# EAGLE design ProtoHu_revA_layer1 (EAGLE 9.4.0)
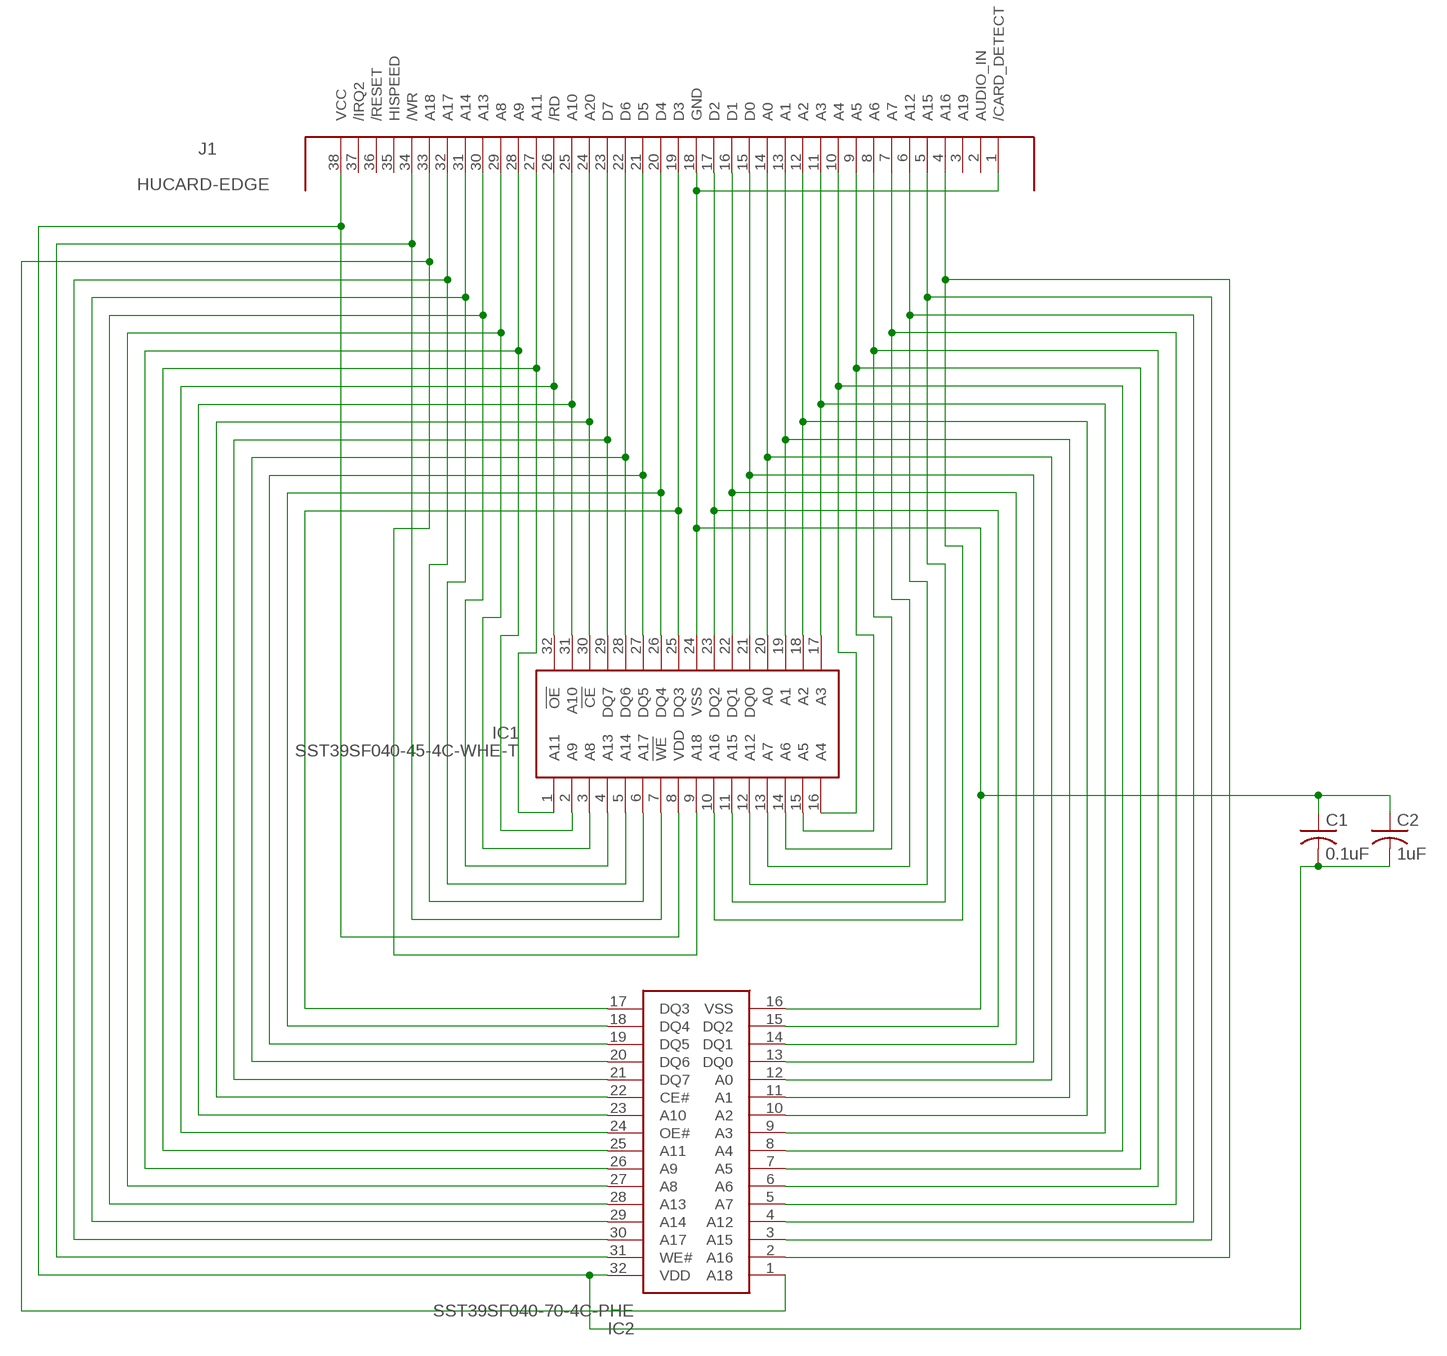
[diagram p0: schematic, sheet 1]

## Parts
C1  0.1uF  C-USC0603  [C0603]
C2  1uF  C-USC0603  [C0603]
IC1  SST39SF040-45-4C-WHE-T  [SOP50P1400X120-32N]
IC2  SST39SF040-70-4C-PHE  [DIP1556W56P254L4191H508Q32N]
J1  HUCARD-EDGE  [HUCARD-EDGE]

## Nets
GND: C1.1 C2.1 IC1.24(VSS) IC2.16(VSS) J1.1(/CARD_DETECT) J1.18(GND)
N$1: IC1.14(A6) IC2.6(A6) J1.8(A6)
N$2: IC1.13(A7) IC2.5(A7) J1.7(A7)
N$3: IC1.12(A12) IC2.4(A12) J1.6(A12)
N$4: IC1.25(DQ3) IC2.17(DQ3) J1.19(D3)
N$5: IC1.26(DQ4) IC2.18(DQ4) J1.20(D4)
N$6: IC1.27(DQ5) IC2.19(DQ5) J1.21(D5)
N$7: IC1.11(A15) IC2.3(A15) J1.5(A15)
N$8: IC1.10(A16) IC2.2(A16) J1.4(A16)
N$9: IC1.23(DQ2) IC2.15(DQ2) J1.17(D2)
N$10: IC1.22(DQ1) IC2.14(DQ1) J1.16(D1)
N$11: IC1.21(DQ0) IC2.13(DQ0) J1.15(D0)
N$12: IC1.7(!WE) IC2.31(WE#) J1.34(/WR)
N$14: IC1.28(DQ6) IC2.20(DQ6) J1.22(D6)
N$15: IC1.29(DQ7) IC2.21(DQ7) J1.23(D7)
N$16: IC1.30(!CE) IC2.22(CE#) J1.24(A20)
N$17: IC1.31(A10) IC2.23(A10) J1.25(A10)
N$18: IC1.32(!OE) IC2.24(OE#) J1.26(/RD)
N$19: IC1.1(A11) IC2.25(A11) J1.27(A11)
N$20: IC1.2(A9) IC2.26(A9) J1.28(A9)
N$21: IC1.20(A0) IC2.12(A0) J1.14(A0)
N$22: IC1.19(A1) IC2.11(A1) J1.13(A1)
N$23: IC1.18(A2) IC2.10(A2) J1.12(A2)
N$24: IC1.17(A3) IC2.9(A3) J1.11(A3)
N$25: IC1.3(A8) IC2.27(A8) J1.29(A8)
N$26: IC1.4(A13) IC2.28(A13) J1.30(A13)
N$27: IC1.5(A14) IC2.29(A14) J1.31(A14)
N$28: IC1.6(A17) IC2.30(A17) J1.32(A17)
N$29: IC1.16(A4) IC2.8(A4) J1.10(A4)
N$30: IC1.15(A5) IC2.7(A5) J1.9(A5)
N$31: IC1.9(A18) IC2.1(A18) J1.33(A18)
VCC: C1.2 C2.2 IC1.8(VDD) IC2.32(VDD) J1.38(VCC)
Unconnected: J1.2(AUDIO_IN) J1.3(A19) J1.35(HISPEED) J1.36(/RESET) J1.37(/IRQ2)

## Library data of the parts
C1 C2 = resistor:C-US: CAPACITOR, American symbol
IC1 = PC-Engine:SST39SF040-45-4C-WHE-T: Flash Memory 4.5 to 5.5 4Mbit Multi-Purpose Flash Source: Datasheet <https://componentsearchengine.com/Datasheets/1/SST39SF040-45-4C-WHE-T.pdf>; DESCRIPTION: Flash Memory 4.5 to 5.5 4Mbit Multi-Purpose Flash; HEIGHT: 1.2mm; MANUFACTURER_NAME: Microchip; MANUFACTURER_PART_NUMBER: SST39SF040-45-4C-WHE-T; MOUSER_PART_NUMBER: 579-39SF0404CWHET; MOUSER_PRICE-STOCK: https://www.mouser.com/Search/Refine.aspx?Keyword=579-39SF0404CWHET
IC2 = PC-Engine:SST39SF040-70-4C-PHE: Microchip SST39SF040-70-4C-PHE, Parallel, Serial 4Mbit Flash Memory, 70ns; 5V, PDIP, 32-Pin Source: Datasheet <http://ww1.microchip.com/downloads/en/DeviceDoc/20005022C.pdf>; ALLIED_NUMBER: 70048094; ALLIED_PRICE-STOCK: https://www.alliedelec.com/microchip-technology-inc-sst39sf040-70-4c-phe/70048094/; DESCRIPTION: Microchip SST39SF040-70-4C-PHE, Parallel, Serial 4Mbit Flash Memory, 70ns; 5V, PDIP, 32-Pin; HEIGHT: 5.08mm; MANUFACTURER_NAME: Microchip; MANUFACTURER_PART_NUMBER: SST39SF040-70-4C-PHE; MOUSER_PART_NUMBER: 804-39SF0407CPHE; MOUSER_PRICE-STOCK: https://www.mouser.com/Search/Refine.aspx?Keyword=804-39SF0407CPHE; RS_PART_NUMBER: 8104037P; RS_PRICE-STOCK: http://uk.rs-online.com/web/p/products/8104037P
J1 = PC-Engine:HUCARD-EDGE: This is a card-edge connector for PC Engine HuCards. The package origin identifies the corner of an un-mitered HuCard. There is a mask 'kepout' area at the edges to allow for artwork/soldermask at the edge

## Board
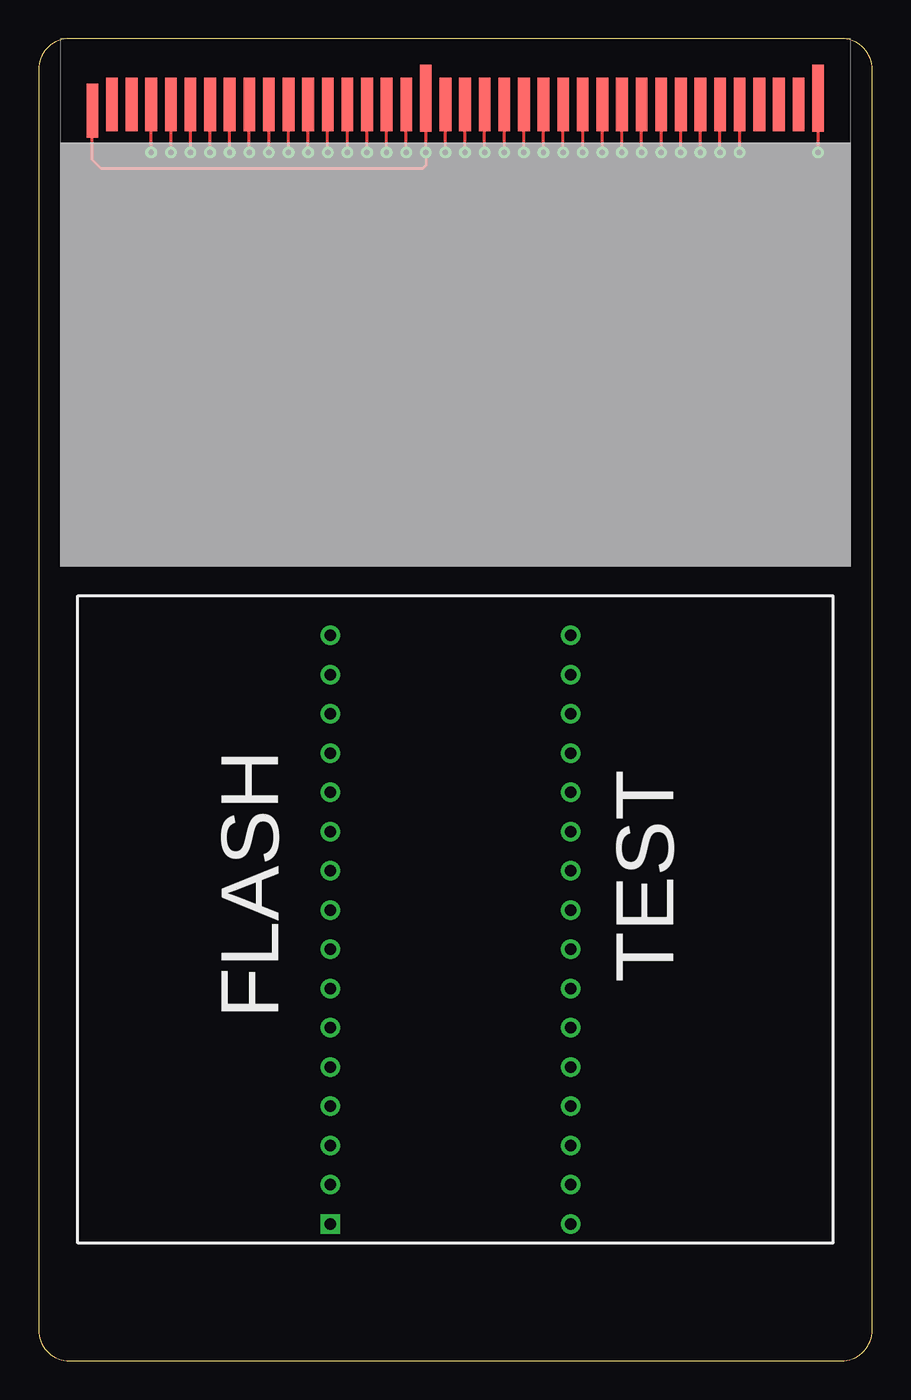
[diagram p1: board, top side]
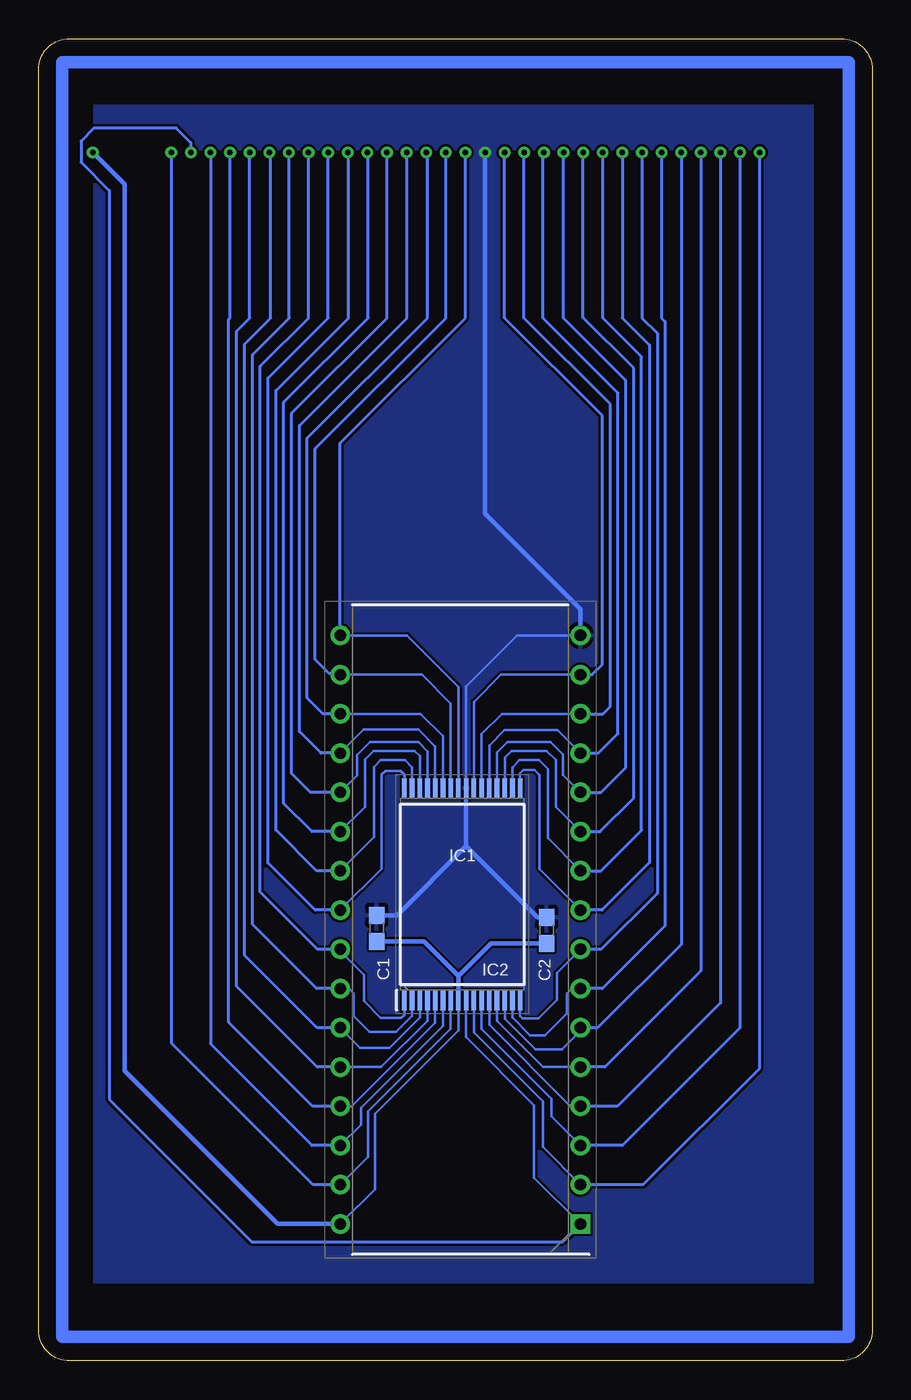
[diagram p2: board, bottom side, seen from below]

Size 53.98 x 85.6 mm. Coordinates in mm from the lower left corner, seen from the top.
Outline: 0,83.6 0,2 arc90 2,0 51.98,0 arc90 53.98,2 53.98,83.6 arc90 51.98,85.6 2,85.6 arc90 0,83.6
Copper layers (1*16): Top 0.035mm / dielectric 1.5mm / Bottom 0.035mm
Design rules "default *": minimum track width 6mil, minimum drill 0.35mm, track to track 6mil, track to pad 6mil, pad to pad 6mil, via to via 6mil, smd to smd 6mil, copper to edge 30mil, drill to drill 6mil, minimum pad ring 10mil, minimum via ring 8mil, stop-mask expansion 4mil, vias tented up to drill 20mil, thermal gap 10mil

### Footprints (pad centres in the part's own frame; a part is rotated, then mirrored left to right if it is on the bottom)
C0603 = smd 1.1 x 1: 1 -0.85,0; 2 0.85,0
SOP50P1400X120-32N = smd 1.3 x 0.3: 1 -6.85,3.75; 2 -6.85,3.25; 3 -6.85,2.75; 4 -6.85,2.25; 5 -6.85,1.75; 6 -6.85,1.25; 7 -6.85,0.75; 8 -6.85,0.25; 9 -6.85,-0.25; 10 -6.85,-0.75; 11 -6.85,-1.25; 12 -6.85,-1.75; 13 -6.85,-2.25; 14 -6.85,-2.75; 15 -6.85,-3.25; 16 -6.85,-3.75; 17 6.85,-3.75; 18 6.85,-3.25; 19 6.85,-2.75; 20 6.85,-2.25; 21 6.85,-1.75; 22 6.85,-1.25; 23 6.85,-0.75; 24 6.85,-0.25; 25 6.85,0.25; 26 6.85,0.75; 27 6.85,1.25; 28 6.85,1.75; 29 6.85,2.25; 30 6.85,2.75; 31 6.85,3.25; 32 6.85,3.75
DIP1556W56P254L4191H508Q32N = drill 0.758 pad 1.158 square: 1 -7.779,19.05 | drill 0.758 pad 1.158: 2 -7.779,16.51; 3 -7.779,13.97; 4 -7.779,11.43; 5 -7.779,8.89; 6 -7.779,6.35; 7 -7.779,3.81; 8 -7.779,1.27; 9 -7.779,-1.27; 10 -7.779,-3.81; 11 -7.779,-6.35; 12 -7.779,-8.89; 13 -7.779,-11.43; 14 -7.779,-13.97; 15 -7.779,-16.51; 16 -7.779,-19.05; 17 7.779,-19.05; 18 7.779,-16.51; 19 7.779,-13.97; 20 7.779,-11.43; 21 7.779,-8.89; 22 7.779,-6.35; 23 7.779,-3.81; 24 7.779,-1.27; 25 7.779,1.27; 26 7.779,3.81; 27 7.779,6.35; 28 7.779,8.89; 29 7.779,11.43; 30 7.779,13.97; 31 7.779,16.51; 32 7.779,19.05
HUCARD-EDGE = smd 0.762 x 3.48: 1 3.48,-4.674; 2 4.75,-4.267; 3 6.02,-4.267; 4 7.29,-4.267; 5 8.56,-4.267; 6 9.83,-4.267; 7 11.1,-4.267; 8 12.37,-4.267; 9 13.64,-4.267; 10 14.91,-4.267; 11 16.18,-4.267; 12 17.45,-4.267; 13 18.72,-4.267; 14 19.99,-4.267; 15 21.26,-4.267; 16 22.53,-4.267; 17 23.8,-4.267; 19 26.34,-4.267; 20 27.61,-4.267; 21 28.88,-4.267; 22 30.15,-4.267; 23 31.42,-4.267; 24 32.69,-4.267; 25 33.96,-4.267; 26 35.23,-4.267; 27 36.5,-4.267; 28 37.77,-4.267; 29 39.04,-4.267; 30 40.31,-4.267; 31 41.58,-4.267; 32 42.85,-4.267; 33 44.12,-4.267; 34 45.39,-4.267; 35 46.66,-4.267; 36 47.93,-4.267; 37 49.2,-4.267 | smd 0.762 x 4.318: 18 25.07,-3.861; 38 50.47,-3.861

### Placement (x,y rotation side)
C1  32.08,27.99 270 bottom
C2  21.08,27.86 270 bottom
IC1  26.54,30.2 90 bottom
IC2  26.67,27.91 180 bottom
J1  0,85.6 0 top

### Tracks (layer width: path | path; a pad name or v marks a point on that pad's centre or on a via)
GND  (via drill 0.35)
  Top 0.203: J1.1 3.48,77.75 4.04,77.19 24.87,77.19 25.07,77.39 v25.07,78.23 J1.18
  Bottom 0.152: IC2.16 22.99,46.97 26.29,43.66 IC1.24
  Bottom 0.305: v25.07,78.23 25.07,54.84 18.89,48.66 IC2.16 | IC1.24 26.29,33.33 | C2.1 21.68,28.71 26.29,33.33 | 26.29,33.33 30.78,28.84 C1.1
  pour Bottom: 3.91,5.11 50.32,5.11 50.32,81.23 3.91,81.23
N$1  (via drill 0.35)
  Top 0.203: v12.37,78.23 J1.8
  Bottom 0.152: IC1.14 23.79,22.15 21.81,20.17 20.09,20.17 18.69,21.57
  Bottom 0.203: v12.37,78.23 12.37,26.98 17.78,21.57 18.69,21.57 IC2.6
N$2  (via drill 0.35)
  Top 0.203: v11.1,78.23 J1.7
  Bottom 0.152: IC1.13 24.29,22 21.32,19.02 IC2.5
  Bottom 0.203: v11.1,78.23 11.1,25.25 17.32,19.02 IC2.5
N$3  (via drill 0.35)
  Top 0.203: v9.83,78.23 J1.6
  Bottom 0.152: IC1.12 24.79,21.75 19.53,16.48 IC2.4
  Bottom 0.203: v9.83,78.23 9.83,23.16 16.51,16.48 IC2.4
N$4  (via drill 0.35)
  Top 0.203: v26.34,78.23 J1.19
  Bottom 0.152: IC1.25 26.79,43.63 30.12,46.97 IC2.17
  Bottom 0.203: IC2.17 34.45,59.4 26.34,67.51 v26.34,78.23
N$5  (via drill 0.35)
  Top 0.203: v27.61,78.23 J1.20
  Bottom 0.152: IC2.18 29.16,44.42 27.29,42.56 IC1.26
  Bottom 0.203: IC2.18 34.52,44.5 35.18,44.5 36.07,45.39 36.07,59.05 27.61,67.51 v27.61,78.23
N$6  (via drill 0.35)
  Top 0.203: v28.88,78.23 J1.21
  Bottom 0.152: IC2.19 29.23,41.88 27.79,40.44 IC1.27
  Bottom 0.203: IC2.19 35.56,41.88 36.58,42.9 36.58,59.74 28.8,67.51 28.8,78.16 v28.88,78.23
N$7  (via drill 0.35)
  Top 0.203: J1.5 v8.56,78.23
  Bottom 0.152: IC1.11 25.29,21.48 20.78,16.97 20.78,15.83 IC2.3
  Bottom 0.203: v8.56,78.23 8.56,21.57 16.18,13.95 IC2.3
N$8  (via drill 0.35)
  Top 0.203: v7.29,78.23 J1.4
  Bottom 0.152: IC1.10 25.79,21.25 21.33,16.79 21.33,13.84 IC2.2
  Bottom 0.203: IC2.2 14.83,11.4 7.29,18.95 v7.29,78.23
N$9  (via drill 0.35)
  Top 0.203: v23.8,78.23 J1.17
  Bottom 0.152: IC2.15 24.03,44.42 25.79,42.66 IC1.23
  Bottom 0.203: IC2.15 18.14,44.42 17.48,45.09 17.48,61.19 23.8,67.51 v23.8,78.23
N$10  (via drill 0.35)
  Top 0.203: v22.53,78.23 J1.16
  Bottom 0.152: IC2.14 23.98,41.88 25.29,40.57 IC1.22
  Bottom 0.203: IC2.14 17.45,41.88 16.97,42.37 16.97,61.92 22.55,67.51 22.55,78.21 v22.53,78.23
N$11  (via drill 0.35)
  Top 0.203: v21.26,78.23 J1.15
  Bottom 0.152: IC2.13 20.39,40.84 23.8,40.84 24.79,39.85 IC1.21
  Bottom 0.203: IC2.13 17.73,39.34 16.46,40.62 16.46,62.66 21.31,67.51 21.31,78.18 v21.26,78.23
N$12  (via drill 0.35)
  Top 0.203: v45.39,78.23 J1.34
  Bottom 0.152: IC1.7 27.29,21.5 32.65,16.15 32.65,13.21 IC2.31
  Bottom 0.203: IC2.31 36.2,11.4 45.39,20.6 v45.39,78.23
N$13
  Bottom 0.813: 1.52,84.07 1.52,1.55 52.45,1.55 52.45,84.07 1.52,84.07
N$14  (via drill 0.35)
  Top 0.203: v30.15,78.23 J1.22
  Bottom 0.152: IC2.20 32.92,40.87 29.39,40.87 28.29,39.77 IC1.28
  Bottom 0.203: IC2.20 35.69,39.34 37.08,40.74 37.08,60.55 30.12,67.51 30.12,78.21 v30.15,78.23
N$15  (via drill 0.35)
  Top 0.203: v31.42,78.23 J1.23
  Bottom 0.152: IC2.21 33.35,37.9 33.35,39.22 32.51,40.06 29.39,40.06 28.79,39.46 IC1.29
  Bottom 0.203: IC2.21 36.37,36.8 37.59,38.02 37.59,61.34 31.42,67.51 v31.42,78.23
N$16  (via drill 0.35)
  Top 0.203: v32.69,78.23 J1.24
  Bottom 0.152: IC2.22 32.84,35.87 32.84,38.94 32.28,39.5 29.64,39.5 29.29,39.15 IC1.30
  Bottom 0.203: IC2.22 36.27,34.27 38.1,36.09 38.1,62.05 32.64,67.51 32.64,78.18 v32.69,78.23
N$17  (via drill 0.35)
  Top 0.203: v33.96,78.23 J1.25
  Bottom 0.152: IC2.23 32.26,33.92 32.26,38.46 31.83,38.89 30.25,38.89 29.79,38.43 IC1.31
  Bottom 0.203: IC2.23 35.97,31.73 38.61,34.37 38.61,62.81 33.91,67.51 33.91,78.18 v33.96,78.23
N$18  (via drill 0.35)
  Top 0.203: v35.23,78.23 J1.26
  Bottom 0.152: IC1.32 30.29,37.96 30.53,38.2 31.52,38.2 31.77,37.95 31.77,31.86 IC2.24
  Bottom 0.203: IC2.24 36.07,29.18 39.12,32.23 39.12,63.63 35.23,67.51 v35.23,78.23
N$19  (via drill 0.35)
  Top 0.203: v36.5,78.23 J1.27
  Bottom 0.152: IC1.1 30.29,22.4 30.5,22.2 31.83,22.2 32.92,23.29 32.92,24.99 34.45,26.52 IC2.25
  Bottom 0.203: IC2.25 35.92,26.64 39.62,30.35 39.62,64.39 36.5,67.51 v36.5,78.23
N$20  (via drill 0.35)
  Top 0.203: v37.77,78.23 J1.28
  Bottom 0.152: IC2.26 33.88,24.11 33.58,23.8 33.58,22.33 32.54,21.29 30.84,21.29 29.79,22.33 IC1.2
  Bottom 0.203: IC2.26 35.97,24.11 40.13,28.27 40.13,65.13 37.74,67.51 37.74,78.21 v37.77,78.23
N$21  (via drill 0.35)
  Top 0.203: v19.99,78.23 J1.14
  Bottom 0.152: IC2.12 20.02,37.93 20.02,39.24 20.83,40.06 23.62,40.06 24.29,39.38 IC1.20
  Bottom 0.203: IC2.12 17.55,36.8 15.95,38.41 15.95,63.48 19.99,67.51 v19.99,78.23
N$22  (via drill 0.35)
  Top 0.203: v18.72,78.23 J1.13
  Bottom 0.152: IC2.11 20.47,35.85 20.47,38.89 21.08,39.5 23.34,39.5 23.79,39.05 IC1.19
  Bottom 0.203: IC2.11 17.63,34.27 15.44,36.45 15.44,64.26 18.72,67.54 v18.72,78.23
N$23  (via drill 0.35)
  Top 0.203: v17.45,78.23 J1.12
  Bottom 0.152: IC2.10 21.01,33.84 21.01,38.33 21.57,38.89 22.84,38.89 23.29,38.43 IC1.18
  Bottom 0.203: IC2.10 17.55,31.73 14.94,34.34 14.94,65 17.45,67.51 v17.45,78.23
N$24  (via drill 0.35)
  Top 0.203: v16.18,78.23 J1.11
  Bottom 0.152: IC2.9 21.54,31.83 21.54,37.92 21.87,38.25 22.58,38.25 22.79,38.04 IC1.17
  Bottom 0.203: v16.18,78.23 16.18,67.51 14.43,65.76 14.43,32.26 17.5,29.18 IC2.9
N$25  (via drill 0.35)
  Top 0.203: v39.04,78.23 J1.29
  Bottom 0.152: IC1.3 29.29,22.23 31.25,20.27 33.15,20.27 IC2.27
  Bottom 0.203: IC2.27 35.94,21.57 40.64,26.26 40.64,65.81 38.94,67.51 38.94,78.13 v39.04,78.23
N$26  (via drill 0.35)
  Top 0.203: v40.31,78.23 J1.30
  Bottom 0.152: IC1.4 28.79,22.02 31.79,19.02 IC2.28
  Bottom 0.203: IC2.28 35.94,19.02 41.15,24.23 41.15,66.67 40.31,67.51 v40.31,78.23
N$27  (via drill 0.35)
  Top 0.203: v41.58,78.23 J1.31
  Bottom 0.152: IC1.5 28.29,21.89 33.7,16.48 IC2.29
  Bottom 0.203: IC2.29 36.22,16.48 41.66,21.92 41.66,67.44 41.58,67.51 v41.58,78.23
N$28  (via drill 0.35)
  Top 0.203: v42.85,78.23 J1.32
  Bottom 0.152: IC1.6 27.79,21.69 33.1,16.38 33.1,15.29 IC2.30
  Bottom 0.203: IC2.30 36.27,13.95 42.85,20.52 v42.85,78.23
N$29  (via drill 0.35)
  Top 0.203: v14.91,78.23 J1.10
  Bottom 0.152: IC2.8 20.42,25.11 20.42,23.37 21.61,22.17 22.63,22.17 22.79,22.34 IC1.16
  Bottom 0.203: v14.91,78.23 14.91,67.51 13.92,66.52 13.92,30.28 17.55,26.64 IC2.8
N$30  (via drill 0.35)
  Top 0.203: v13.64,78.23 J1.9
  Bottom 0.152: IC1.15 23.29,22.23 22.15,21.08 21.18,21.08 19.76,22.5 19.76,23.8 19.46,24.11 IC2.7
  Bottom 0.203: v13.64,78.23 13.64,67.51 13.41,67.28 13.41,28.17 17.48,24.11 IC2.7
N$31  (via drill 0.35)
  Top 0.203: v44.12,78.23 J1.33
  Bottom 0.152: IC1.9 26.29,20.96 21.89,16.55 21.89,11.86 IC2.1
  Bottom 0.203: IC2.1 20.03,7.72 40.18,7.72 49.4,16.94 49.4,75.77 51.23,77.6 51.23,78.97 50.39,79.81 45.06,79.81 44.12,78.87 v44.12,78.23
VCC  (via drill 0.35)
  Top 0.203: v50.47,78.23 J1.38
  Bottom 0.152: IC2.32 32.21,11.11 32.21,15.98 26.79,21.39 IC1.8
  Bottom 0.305: IC2.32 38.51,8.87 48.41,18.77 48.41,76.17 v50.47,78.23 | IC1.8 26.79,24.91 | C1.2 29.02,27.14 26.79,24.91 | 26.79,24.91 24.69,27.01 C2.2

### Text on the board
tNames: FLASH | TEST
bValues: JLCJLCJLCJLC